# Altium schematic sheet demo_V1 SMALL SIZE.SchDoc: Sinowealth SH32F205 inverter AIR Conditioner
size A2; DocumentNumber: 1; Revision: V2.0; SheetNumber: 1; SheetTotal: 3; DrawnBy: Shawn; PageSetup: Record=PageOptions|CenterHorizontal=True|CenterVertical=True|PrintScale=0.71|XCorrection=1.00|YCorrection=1.00|PrintKind=2|BorderSize=5000000|LeftOffset=0|BottomOffset=0|Orientation=2|PaperLength=1000|PaperWidth=1000|Scale=100|PaperSource=7|PrintQuality=-4|MediaType=1|DitherType=10|PaperKind=A4|PrintScaleMode=1
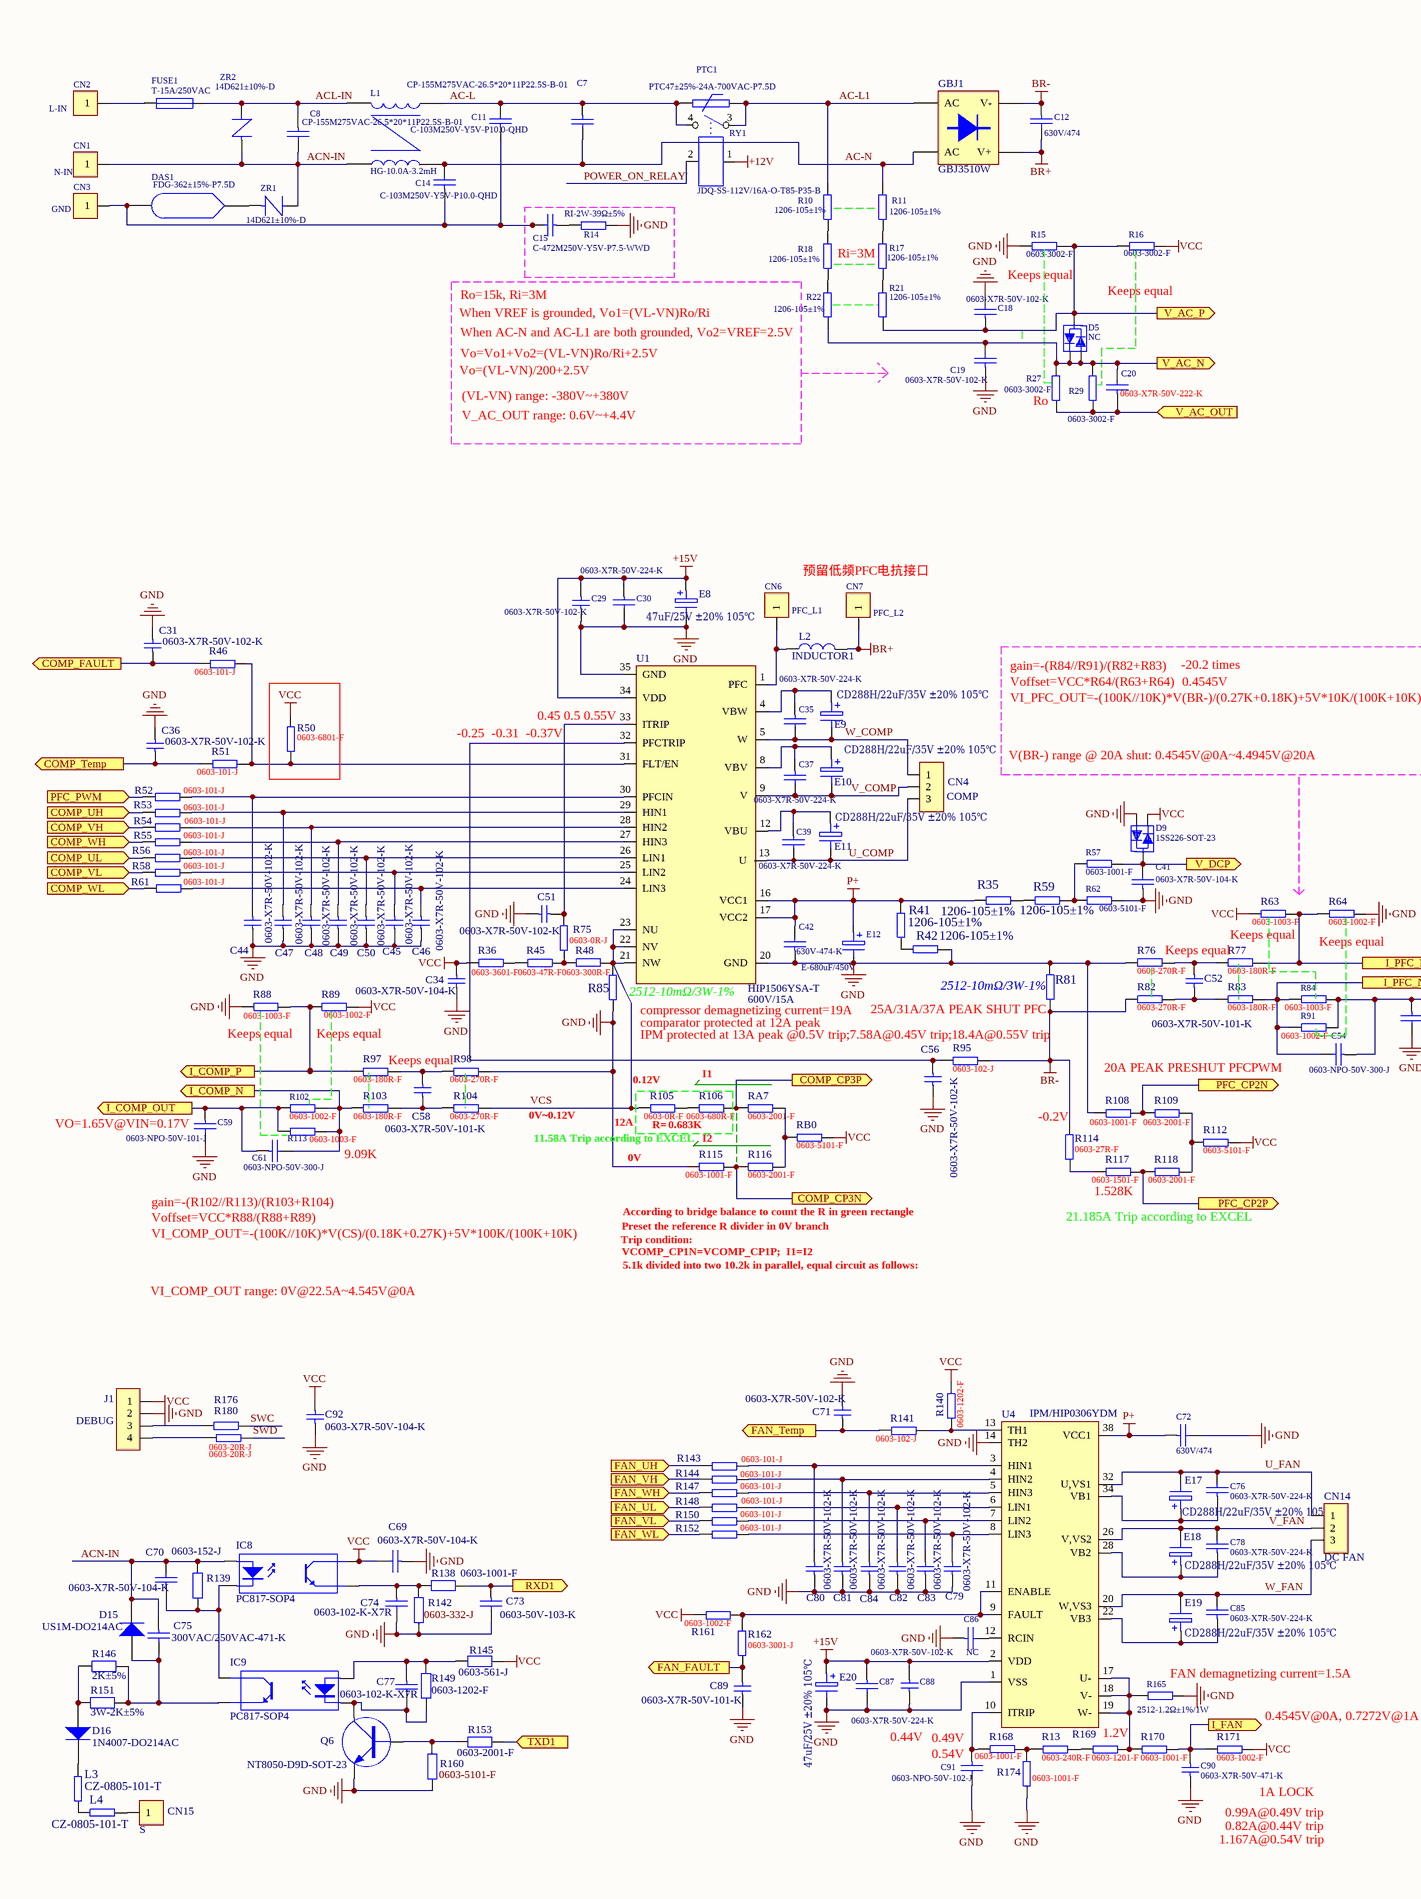
[diagram p0: demo_V1 SMALL SIZE.SchDoc, left]
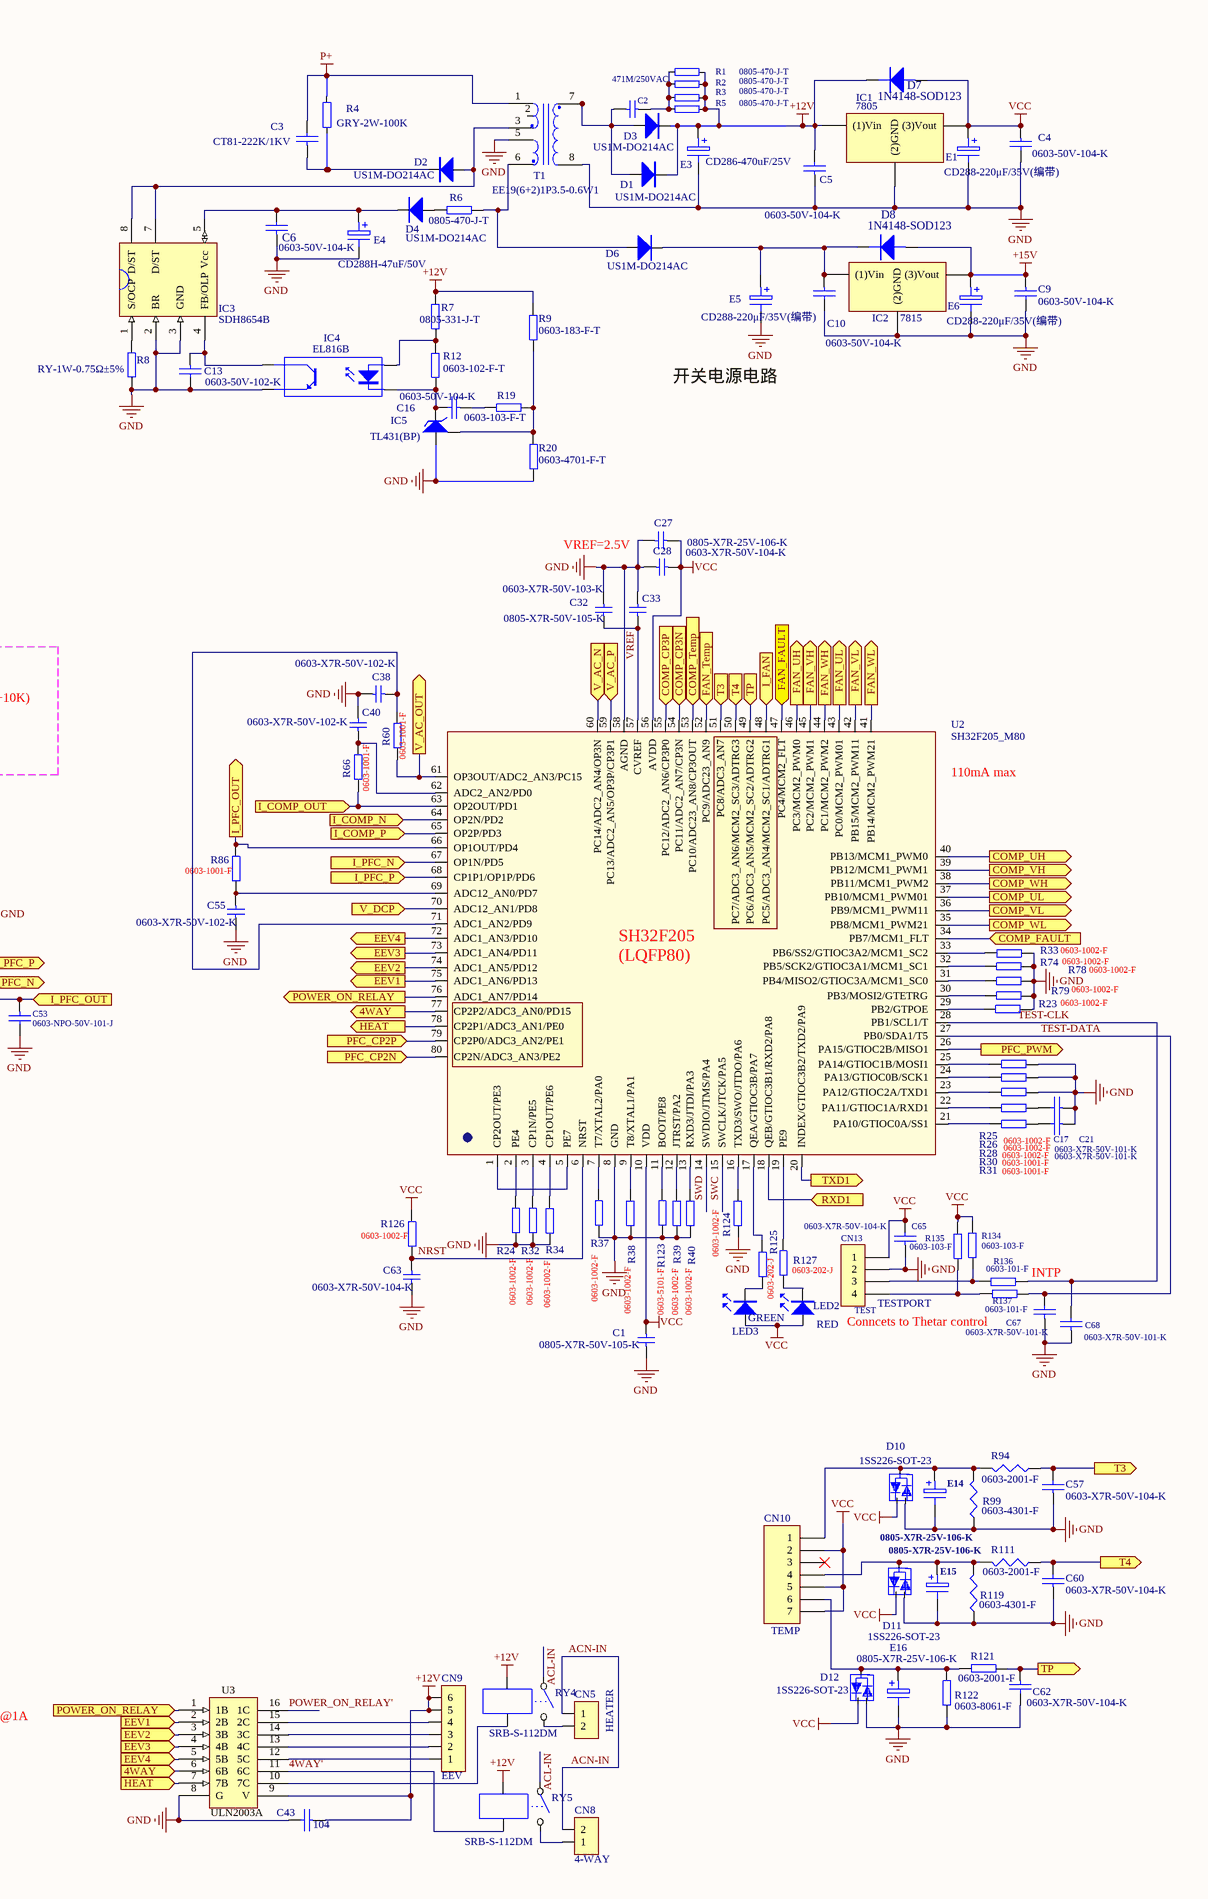
[diagram p1: demo_V1 SMALL SIZE.SchDoc, right]

## Parts
C1  0805-X7R-50V-105-K  [R-SMT-SP-CAP/0805]
C2  471M/250VAC  [S-C/5-AI]
C3  CT81-222K/1KV  [S-C/5-AI]
C4  0603-50V-104-K  [R-SMT-SP-CAP/0603]
C5  0603-50V-104-K  [R-SMT-SP-CAP/0603]
C6  0603-50V-104-K  [R-SMT-SP-CAP/0603]
C7  CP-155M275VAC-26.5*20*11P22.5S-B-01  [S-C/22.5]
C8  CP-155M275VAC-26.5*20*11P22.5S-B-01  [S-C/22.5]
C9  0603-50V-104-K  [R-SMT-SP-CAP/0603]
C10  0603-50V-104-K  [R-SMT-SP-CAP/0603]
C11  C-103M250V-Y5V-P10.0-QHD  [S-C/7.5+10/13X3-AI]
C12  630V/474  [S-C/22.5/25X8.5]
C13  0603-50V-102-K  [R-SMT-SP-CAP/0603]
C14  C-103M250V-Y5V-P10.0-QHD  [S-C/7.5+10/13X3-AI]
C15  C-472M250V-Y5V-P7.5-WWD  [S-C/7.5+10/13X3-AI]
C16  0603-50V-104-K  [R-SMT-SP-CAP/0603]
C17  0603-X7R-50V-101-K  [C/0603-SMT]
C18  0603-X7R-50V-102-K  [R-SMT-SP-CAP/0603]
C19  0603-X7R-50V-102-K  [R-SMT-SP-CAP/0603]
C20  0603-X7R-50V-222-K  [R-SMT-SP-CAP/0603]
C21  0603-X7R-50V-101-K  [C/0603-SMT]
C27  0805-X7R-25V-106-K  [R-SMT-SP-CAP/0805]
C28  0603-X7R-50V-104-K  [R-SMT-SP-CAP/0603]
C29  0603-X7R-50V-102-K  [R-SMT-SP-CAP/0603]
C30  0603-X7R-50V-224-K  [R-SMT-SP-CAP/0603]
C31  0603-X7R-50V-102-K  [R-SMT-SP-CAP/0603]
C32  0805-X7R-50V-105-K  [R-SMT-SP-CAP/0805]
C33  0603-X7R-50V-103-K  [R-SMT-SP-CAP/0603]
C34  0603-X7R-50V-104-K  [R-SMT-SP-CAP/0603]
C35  0603-X7R-50V-224-K  [R-SMT-SP-CAP/0603]
C36  0603-X7R-50V-102-K  [R-SMT-SP-CAP/0603]
C37  0603-X7R-50V-224-K  [R-SMT-SP-CAP/0603]
C38  0603-X7R-50V-102-K  [R-SMT-SP-CAP/0603]
C39  0603-X7R-50V-224-K  [R-SMT-SP-CAP/0603]
C40  0603-X7R-50V-102-K  [R-SMT-SP-CAP/0603]
C41  0603-X7R-50V-104-K  [R-SMT-SP-CAP/0603]
C42  630V-474-K  [C/15/17/8.2]
C43  104  [C/0805]
C44  0603-X7R-50V-102-K  [R-SMT-SP-CAP/0603]
C45  0603-X7R-50V-102-K  [R-SMT-SP-CAP/0603]
C46  0603-X7R-50V-102-K  [R-SMT-SP-CAP/0603]
C47  0603-X7R-50V-102-K  [R-SMT-SP-CAP/0603]
C48  0603-X7R-50V-102-K  [R-SMT-SP-CAP/0603]
C49  0603-X7R-50V-102-K  [R-SMT-SP-CAP/0603]
C50  0603-X7R-50V-102-K  [R-SMT-SP-CAP/0603]
C51  0603-X7R-50V-102-K  [R-SMT-SP-CAP/0603]
C52  0603-X7R-50V-101-K  [R-SMT-SP-CAP/0603]
C53  0603-NPO-50V-101-J  [R-SMT-SP-CAP/0603]
C54  0603-NPO-50V-300-J  [R-SMT-SP-CAP/0603]
C55  0603-X7R-50V-102-K  [R-SMT-SP-CAP/0603]
C56  0603-X7R-50V-102-K  [R-SMT-SP-CAP/0603]
C57  0603-X7R-50V-104-K  [R-SMT-SP-CAP/0603]
C58  0603-X7R-50V-101-K  [R-SMT-SP-CAP/0603]
C59  0603-NPO-50V-101-J  [R-SMT-SP-CAP/0603]
C60  0603-X7R-50V-104-K  [R-SMT-SP-CAP/0603]
C61  0603-NPO-50V-300-J  [R-SMT-SP-CAP/0603]
C62  0603-X7R-50V-104-K  [R-SMT-SP-CAP/0603]
C63  0603-X7R-50V-104-K  [R-SMT-SP-CAP/0603]
C65  0603-X7R-50V-104-K  [C/0603-SMT]
C67  0603-X7R-50V-101-K  [C/0603-SMT]
C68  0603-X7R-50V-101-K  [C/0603-SMT]
C69  0603-X7R-50V-104-K  [R-SMT-SP-CAP/0603]
C70  0603-X7R-50V-104-K  [R-SMT-SP-CAP/0603]
C71  0603-X7R-50V-102-K  [R-SMT-SP-CAP/0603]
C72  630V/474  [C/15/17/8.2]
C73  0603-50V-103-K  [R-SMT-SP-CAP/0603]
C74  0603-102-K-X7R  [R-SMT-SP-CAP/0603]
C75  300VAC/250VAC-471-K  [S-C/7.5]
C76  0603-X7R-50V-224-K  [R-SMT-SP-CAP/0603]
C77  0603-102-K-X7R  [R-SMT-SP-CAP/0603]
C78  0603-X7R-50V-224-K  [R-SMT-SP-CAP/0603]
C79  0603-X7R-50V-102-K  [R-SMT-SP-CAP/0603]
C80  0603-X7R-50V-102-K  [R-SMT-SP-CAP/0603]
C81  0603-X7R-50V-102-K  [R-SMT-SP-CAP/0603]
C82  0603-X7R-50V-102-K  [R-SMT-SP-CAP/0603]
C83  0603-X7R-50V-102-K  [R-SMT-SP-CAP/0603]
C84  0603-X7R-50V-102-K  [R-SMT-SP-CAP/0603]
C85  0603-X7R-50V-224-K  [R-SMT-SP-CAP/0603]
C86  NC  [R-SMT-SP-CAP/0603]
C87  0603-X7R-50V-224-K  [R-SMT-SP-CAP/0603]
C88  0603-X7R-50V-102-K  [R-SMT-SP-CAP/0603]
C89  0603-X7R-50V-101-K  [R-SMT-SP-CAP/0603]
C90  0603-X7R-50V-471-K  [R-SMT-SP-CAP/0603]
C91  0603-NPO-50V-102-J  [R-SMT-SP-CAP/0603]
C92  0603-X7R-50V-104-K  [R-SMT-SP-CAP/0603]
CN1  N-IN  [0-P]
CN2  L-IN  [0-P]
CN3  GND  [S-P/0/2.5/4.5]
CN4  COMP  [R-SC-CN/FD/4/4/20/8.6(VH-5K2,4)]
CN5  HEATER  [S-CN/7.92/2/L]
CN6  PFC_L1  [R-SC-P/TP2.5SING(14AWG)]
CN7  PFC_L2  [R-SC-P/TP2.5SING(14AWG)]
CN8  4-WAY  [S-CN/7.92/2/L]
CN9  EEV  [S-CN/2.54/6/L]
CN10  TEMP  [R-SC-CN/2.5/7/11.5/4.5/JS]
CN13  TEST  [S-CN/2.54/4/L]
CN14  DC FAN  [R-SC-CN/FD/4/4/20/8.6(VH-5K2,4)]
CN15  S  [0-P]
D1  US1M-DO214AC  [D/SUF4007]
D2  US1M-DO214AC  [D/SUF4007]
D3  US1M-DO214AC  [D/SUF4007]
D4  US1M-DO214AC  [D/SUF4007]
D5  NC  [D/TYPE/1SS226-SMT]
D6  US1M-DO214AC  [D/SUF4007]
D7  1N4148-SOD123  [D/SOD123-SMT]
D8  1N4148-SOD123  [D/SOD123-SMT]
D9  1SS226-SOT-23  [D/TYPE/1SS226-SMT]
D10  1SS226-SOT-23  [D/TYPE/1SS226-SMT]
D11  1SS226-SOT-23  [D/TYPE/1SS226-SMT]
D12  1SS226-SOT-23  [D/TYPE/1SS226-SMT]
D15  US1M-DO214AC  [D/DO214AC-SMT]
D16  1N4007-DO214AC  [D/DO214AC-SMT]
DAS1  FDG-362±15%-P7.5D  [S-DSA/7.5/0.9-AI]
E1  CD288-220μF/35V(编带)  [R-SC-CAP-EC/5/8]
E3  CD286-470uF/25V  [E/5/11-AI]
E4  CD288H-47uF/50V  [E/2.54/6.5-AI]
E5  CD288-220μF/35V(编带)  [R-SC-CAP-EC/5/8]
E6  CD288-220μF/35V(编带)  [R-SC-CAP-EC/5/8]
E8  47uF/25V ±20% 105℃  [E/2.5/5/E1@]
E9  CD288H/22uF/35V ±20% 105℃  [E/2.5/5/E1@]
E10  CD288H/22uF/35V ±20% 105℃  [E/2.5/5/E1@]
E11  CD288H/22uF/35V ±20% 105℃  [E/2.5/5/E1@]
E12  E-680uF/450V  [S-E/10/36L-1]
E14  0805-X7R-25V-106-K  [R-SMT-SP-CAP/0805]
E15  0805-X7R-25V-106-K  [R-SMT-SP-CAP/0805]
E16  0805-X7R-25V-106-K  [R-SMT-SP-CAP/0805]
E17  CD288H/22uF/35V ±20% 105℃  [E/2.5/5/E1@]
E18  CD288H/22uF/35V ±20% 105℃  [E/2.5/5/E1@]
E19  CD288H/22uF/35V ±20% 105℃  [E/2.5/5/E1@]
E20  47uF/25V ±20% 105℃  [E/2.5/5/E1@]
FUSE1  T-15A/250VAC  [S-FU/2/32/7]
GBJ1  GBJ3510W  [R-SC-DIO-DB/AC-DC1(WS)]
IC1  7805  [R-SMT-SP-IC/78XX]
IC2  7815  [R-SMT-SP-IC/78XX]
IC3  SDH8654B  [IC/DIP/8]
IC4  EL816B  [IC/DIP/4/1]
IC5  TL431(BP)  [Q/SOT23-SMT-431]
IC8  PC817-SOP4  [R-SMT-SP-IC/SOP/2.54/4]
IC9  PC817-SOP4  [R-SMT-SP-IC/SOP/2.54/4]
J1  DEBUG  [SIP4]
L1  HG-10.0A-3.2mH  [0-S-L/4/50/35/]
L2  INDUCTOR1  [0-L/10A-400uH]
L3  CZ-0805-101-T  [R/0805-SMT]
L4  CZ-0805-101-T  [R/0805-SMT]
LED2  RED  [R-SMT-SP-LED/0603]
LED3  GREEN  [R-SMT-SP-LED/0603]
PTC1  PTC47±25%-24A-700VAC-P7.5D  [S-PTC/03]
Q6  NT8050-D9D-SOT-23  [Q/SOT23-SMT]
R1  0805-470-J-T  [R/0805]
R2  0805-470-J-T  [R/0805]
R3  0805-470-J-T  [R/0805]
R4  GRY-2W-100K  [S-R/5/2W/R1-AI]
R5  0805-470-J-T  [R/0805]
R6  0805-470-J-T  [R/0805]
R7  0805-331-J-T  [R/0805]
R8  RY-1W-0.75Ω±5%  [S-R/5/1W/R1-AI]
R9  0603-183-F-T  [R-SMT-SP-RES/0603]
R10  1206-105±1%  [R/1206]
R11  1206-105±1%  [R/1206]
R12  0603-102-F-T  [R-SMT-SP-RES/0603]
R13  0603-240R-F  [R-SMT-SP-RES/0603]
R14  RI-2W-39Ω±5%  [S-R/5/1W/R1-AI]
R15  0603-3002-F  [R-SMT-SP-RES/0603]
R16  0603-3002-F  [R-SMT-SP-RES/0603]
R17  1206-105±1%  [R/1206]
R18  1206-105±1%  [R/1206]
R19  0603-103-F-T  [R-SMT-SP-RES/0603]
R20  0603-4701-F-T  [R-SMT-SP-RES/0603]
R21  1206-105±1%  [R/1206]
R22  1206-105±1%  [R/1206]
R23  0603-1002-F  [R-SMT-SP-RES/0603]
R24  0603-1002-F  [R-SMT-SP-RES/0603]
R25  0603-1002-F  [R-SMT-SP-RES/0603]
R26  0603-1002-F  [R-SMT-SP-RES/0603]
R27  0603-3002-F  [R-SMT-SP-RES/0603]
R28  0603-1002-F  [R-SMT-SP-RES/0603]
R29  0603-3002-F  [R-SMT-SP-RES/0603]
R30  0603-1001-F  [R-SMT-SP-RES/0603]
R31  0603-1001-F  [R-SMT-SP-RES/0603]
R32  0603-1002-F  [R-SMT-SP-RES/0603]
R33  0603-1002-F  [R-SMT-SP-RES/0603]
R34  0603-1002-F  [R-SMT-SP-RES/0603]
R35  1206-105±1%  [R/1206-SMT]
R36  0603-3601-F  [R-SMT-SP-RES/0603]
R37  0603-1002-F  [R-SMT-SP-RES/0603]
R38  0603-1002-F  [R-SMT-SP-RES/0603]
R39  0603-1002-F  [R-SMT-SP-RES/0603]
R40  0603-1002-F  [R-SMT-SP-RES/0603]
R41  1206-105±1%  [R/1206-SMT]
R42  1206-105±1%  [R/1206-SMT]
R45  0603-47R-F  [R-SMT-SP-RES/0603]
R46  0603-101-J  [R-SMT-SP-RES/0603]
R48  0603-300R-F  [R-SMT-SP-RES/0603]
R50  0603-6801-F  [R-SMT-SP-RES/0603]
R51  0603-101-J  [R-SMT-SP-RES/0603]
R52  0603-101-J  [R-SMT-SP-RES/0603]
R53  0603-101-J  [R-SMT-SP-RES/0603]
R54  0603-101-J  [R-SMT-SP-RES/0603]
R55  0603-101-J  [R-SMT-SP-RES/0603]
R56  0603-101-J  [R-SMT-SP-RES/0603]
R57  0603-1001-F  [R-SMT-SP-RES/0603]
R58  0603-101-J  [R-SMT-SP-RES/0603]
R59  1206-105±1%  [R/1206-SMT]
R60  0603-1001-F  [R-SMT-SP-RES/0603]
R61  0603-101-J  [R-SMT-SP-RES/0603]
R62  0603-5101-F  [R-SMT-SP-RES/0603]
R63  0603-1003-F  [R-SMT-SP-RES/0603]
R64  0603-1002-F  [R-SMT-SP-RES/0603]
R66  0603-1001-F  [R-SMT-SP-RES/0603]
R74  0603-1002-F  [R-SMT-SP-RES/0603]
R75  0603-0R-J  [R-SMT-SP-RES/0603]
R76  0603-270R-F  [R-SMT-SP-RES/0603]
R77  0603-180R-F  [R-SMT-SP-RES/0603]
R78  0603-1002-F  [R-SMT-SP-RES/0603]
R79  0603-1002-F  [R-SMT-SP-RES/0603]
R81  2512-10mΩ/3W-1%  [R/2512-SMT]
R82  0603-270R-F  [R-SMT-SP-RES/0603]
R83  0603-180R-F  [R-SMT-SP-RES/0603]
R84  0603-1003-F  [R-SMT-SP-RES/0603]
R85  2512-10mΩ/3W-1%  [R/2512-SMT]
R86  0603-1001-F  [R-SMT-SP-RES/0603]
R88  0603-1003-F  [R-SMT-SP-RES/0603]
R89  0603-1002-F  [R-SMT-SP-RES/0603]
R91  0603-1002-F  [R-SMT-SP-RES/0603]
R94  0603-2001-F  [R-SMT-SP-RES/0603]
R95  0603-102-J  [R-SMT-SP-RES/0603]
R97  0603-180R-F  [R-SMT-SP-RES/0603]
R98  0603-270R-F  [R-SMT-SP-RES/0603]
R99  0603-4301-F  [R-SMT-SP-RES/0603]
R102  0603-1002-F  [R-SMT-SP-RES/0603]
R103  0603-180R-F  [R-SMT-SP-RES/0603]
R104  0603-270R-F  [R-SMT-SP-RES/0603]
R105  0603-0R-F  [R-SMT-SP-RES/0603]
R106  0603-680R-F  [R-SMT-SP-RES/0603]
R108  0603-1001-F  [R-SMT-SP-RES/0603]
R109  0603-2001-F  [R-SMT-SP-RES/0603]
R111  0603-2001-F  [R-SMT-SP-RES/0603]
R112  0603-5101-F  [R-SMT-SP-RES/0603]
R113  0603-1003-F  [R-SMT-SP-RES/0603]
R114  0603-27R-F  [R-SMT-SP-RES/0603]
R115  0603-1001-F  [R-SMT-SP-RES/0603]
R116  0603-2001-F  [R-SMT-SP-RES/0603]
R117  0603-1501-F  [R-SMT-SP-RES/0603]
R118  0603-2001-F  [R-SMT-SP-RES/0603]
R119  0603-4301-F  [R-SMT-SP-RES/0603]
R121  0603-2001-F  [R-SMT-SP-RES/0603]
R122  0603-8061-F  [R-SMT-SP-RES/0603]
R123  0603-5101-F  [R-SMT-SP-RES/0603]
R124  0603-1002-F  [R-SMT-SP-RES/0603]
R125  0603-202-J  [R-SMT-SP-RES/0603]
R126  0603-1002-F  [R-SMT-SP-RES/0603]
R127  0603-202-J  [R-SMT-SP-RES/0603]
R134  0603-103-F  [R/0603-SMT]
R135  0603-103-F  [R/0603-SMT]
R136  0603-101-F  [R/0603-SMT]
R137  0603-101-F  [R/0603-SMT]
R138  0603-1001-F  [R-SMT-SP-RES/0603]
R139  0603-152-J  [R-SMT-SP-RES/0603]
R140  0603-1202-F  [R-SMT-SP-RES/0603]
R141  0603-102-J  [R-SMT-SP-RES/0603]
R142  0603-332-J  [R-SMT-SP-RES/0603]
R143  0603-101-J  [R-SMT-SP-RES/0603]
R144  0603-101-J  [R-SMT-SP-RES/0603]
R145  0603-561-J  [R-SMT-SP-RES/0603]
R146  2K±5%  [S-R/5/2W/R1-AI]
R147  0603-101-J  [R-SMT-SP-RES/0603]
R148  0603-101-J  [R-SMT-SP-RES/0603]
R149  0603-1202-F  [R-SMT-SP-RES/0603]
R150  0603-101-J  [R-SMT-SP-RES/0603]
R151  3W-2K±5%  [S-R/10/3W-AI]
R152  0603-101-J  [R-SMT-SP-RES/0603]
R153  0603-2001-F  [R-SMT-SP-RES/0603]
R160  0603-5101-F  [R-SMT-SP-RES/0603]
R161  0603-1002-F  [R-SMT-SP-RES/0603]
R162  0603-3001-J  [R-SMT-SP-RES/0603]
R165  2512-1.2Ω±1%/1W  [R/2512-SMT]
R168  0603-1001-F  [R-SMT-SP-RES/0603]
R169  0603-1201-F  [R-SMT-SP-RES/0603]
R170  0603-1001-F  [R-SMT-SP-RES/0603]
R171  0603-1002-F  [R-SMT-SP-RES/0603]
R174  0603-1001-F  [R-SMT-SP-RES/0603]
R176  0603-20R-J  [R-SMT-SP-RES/0603]
R180  0603-20R-J  [R-SMT-SP-RES/0603]
RA7  0603-2001-F  [R-SMT-SP-RES/0603]
RB0  0603-5101-F  [R-SMT-SP-RES/0603]
RY1  JDQ-SS-112V/16A-O-T85-P35-B  [RY/OJE-SS]
RY4  SRB-S-112DM  [RY/G5N-1A]
RY5  SRB-S-112DM  [RY/G5N-1A]
T1  EE19(6+2)1P3.5-0.6W1  [S-TR/EE1905N111]
U1  HIP1506YSA-T  [IPM/HIP1506YSA-T]
U2  SH32F205_M80  [IC/LQFP80L]
U3  ULN2003A  [IC/SOP/1.27/16-SMT]
U4  IPM/HIP0306YDM  [IPM/HIP0306YDM]
ZR1  14D621±10%-D  [S-ZR/7.5/8/15-AI]
ZR2  14D621±10%-D  [S-ZR/7.5/8/15-AI]

## Ports
4WAY (in), 4WAY (out), COMP_CP3N (in), COMP_CP3N (out), COMP_CP3P (in), COMP_CP3P (out), COMP_FAULT (in), COMP_FAULT (out), COMP_Temp (in), COMP_Temp (out), COMP_UH (in), COMP_UH (out), COMP_UL (in), COMP_UL (out), COMP_VH (in), COMP_VH (out), COMP_VL (in), COMP_VL (out), COMP_WH (in), COMP_WH (out), COMP_WL (in), COMP_WL (out), EEV1 (in), EEV1 (out), EEV2 (in), EEV2 (out), EEV3 (in), EEV3 (out), EEV4 (in), EEV4 (out), FAN_FAULT (in), FAN_FAULT (out), FAN_Temp (in), FAN_Temp (out), FAN_UH (in), FAN_UH (out), FAN_UL (in), FAN_UL (out), FAN_VH (in), FAN_VH (out), FAN_VL (in), FAN_VL (out), FAN_WH (in), FAN_WH (out), FAN_WL (in), FAN_WL (out), HEAT (in), HEAT (out), I_COMP_N (in), I_COMP_N (out), I_COMP_OUT (in), I_COMP_OUT (out), I_COMP_P (in), I_COMP_P (out), I_FAN (in), I_FAN (out), I_PFC_N (in), I_PFC_N (out), I_PFC_OUT (in), I_PFC_OUT (out), I_PFC_P (in), I_PFC_P (out), PFC_CP2N (in), PFC_CP2N (out), PFC_CP2P (in), PFC_CP2P (out), PFC_PWM (in), PFC_PWM (out), POWER_ON_RELAY (in), POWER_ON_RELAY (out), RXD1 (in), RXD1 (out), T3 (in), T3 (out), T4 (in), T4 (out), TP (in), TP (out), TXD1 (in), TXD1 (out), V_AC_N (in), V_AC_N (out), V_AC_OUT (in), V_AC_OUT (out), V_AC_P (in), V_AC_P (out), V_DCP (in), V_DCP (out)

## Nets
1: DAS1.1 ZR1.2
2: C11.1 C14.1 C15.2 CN3.1 DAS1.2
+12V: C5.2 C43.1 CN9.5 CN9.6 D1.K D3.K D7.K E3.1 IC1.1((1)Vin) R1.1 R2.1 R3.1 R5.1 R7.2 R9.2 RY1.1 RY4.3 RY5.3 U3.9(V)
+15V: C9.1 C29.1 C30.1 C87.1 C88.1 D8.A E6.1 E8.1 E20.1 IC2.3((3)Vout) U1.34(VDD) U4.2(VDD)
BR+: C12.2 CN7.1 GBJ1.1(V+) L2.2
BR-: C12.1 GBJ1.4(V-) R81.2 R82.2 R95.2 R114.2
GND: C1.1 C4.2 C5.1 C6.1 C9.2 C10.2 C13.2 C17.1 C18.2 C19.1 C21.1 C27.1 C28.1 C29.2 C30.2 C31.1 C32.2 C33.2 C34.2 C36.1 C38.1 C40.1 C41.1 C42.1 C43.2 C44.2 C45.2 C46.2 C47.2 C48.2 C49.2 C50.2 C51.2 C53.2 C55.2 C56.1 C57.1 C59.2 C60.1 C62.2 C63.2 C65.1 C67.1 C68.1 C69.1 C71.1 C72.2 C73.2 C74.2 C79.2 C80.2 C81.2 C82.2 C83.2 C84.2 C86.1 C87.2 C88.2 C89.2 C90.2 C91.2 C92.1 CN13.2 D9.A D10.A D11.A D12.A E1.2 E3.2 E4.2 E5.2 E6.2 E8.2 E12.2 E14.2 E15.2 E16.2 E20.2 IC1.2((2)GND) IC2.2((2)GND) IC3.2(BR) IC3.3(GND) IC4.E IC5.2 J1.2 Q6.E R8.2 R14.2 R15.1 R20.2 R23.1 R24.2 R25.1 R26.1 R28.1 R32.2 R33.2 R34.1 R37.2 R38.1 R39.1 R40.1 R42.1 R62.1 R64.1 R74.1 R76.2 R78.1 R79.1 R81.1 R85.1 R88.1 R98.2 R99.2 R108.1 R115.1 R119.2 R122.1 R123.2 R124.1 R142.2 R160.2 R165.2 R174.1 T1.5 T1.8 U1.20(GND) U1.35(GND) U2.8(GND) U2.58(AGND) U3.8(G) U4.1(VSS) U4.14(TH2)
P+: C3.2 C42.2 C72.1 E12.1 R4.1 R35.2 R41.2 T1.1 U1.16(VCC1) U1.17(VCC2) U4.38(VCC1)
VCC: C1.2 C4.1 C27.2 C28.2 C34.1 C65.2 C69.2 C92.2 CN10.2 CN10.5 CN10.7 CN13.1 D7.A D9.K D10.K D11.K D12.K E1.1 IC1.3((3)Vout) IC8.C J1.1 LED2.A LED3.A R16.2 R36.1 R50.1 R63.2 R89.2 R112.2 R126.1 R134.2 R135.2 R140.1 R145.1 R161.1 R171.2 RB0.2 U2.10(VDD) U2.56(AVDD)
4WAY: U2.77(CP2P2/ADC3_AN0/PD15) U3.6(6B) ; port 4WAY
4WAY': RY5.4 U3.11(6C)
AC-L: C7.1 C11.2 L1.4 PTC1.1 RY1.4
AC-L1: GBJ1.3(AC) PTC1.2 R10.1 RY1.3
AC-N: C7.2 C14.2 GBJ1.2(AC) L1.3 R11.1
ACL-IN: C8.1 FUSE1.2 L1.2 RY4.1 RY5.1 ZR2.1
ACN-IN: C8.2 C70.2 C75.1 CN1.1 CN5.1 CN8.2 D15.K IC8.A L1.1 R139.1 ZR1.1 ZR2.2
COMP_CP3N: R115.2 R116.1 U2.54(PC11/ADC2_AN7/CP3N) ; port COMP_CP3N
COMP_CP3P: R106.2 RA7.1 U2.55(PC12/ADC2_AN6/CP3P0) ; port COMP_CP3P
COMP_FAULT: C31.2 R46.1 U2.34(PB7/MCM1_FLT) ; port COMP_FAULT
COMP_Temp: C36.2 R51.1 U2.53(PC10/ADC23_AN8/CP3OUT) ; port COMP_Temp
COMP_UH: R53.1 U2.40(PB13/MCM1_PWM0) ; port COMP_UH
COMP_UL: R56.1 U2.37(PB10/MCM1_PWM01) ; port COMP_UL
COMP_VH: R54.1 U2.39(PB12/MCM1_PWM1) ; port COMP_VH
COMP_VL: R58.1 U2.36(PB9/MCM1_PWM11) ; port COMP_VL
COMP_WH: R55.1 U2.38(PB11/MCM1_PWM2) ; port COMP_WH
COMP_WL: R61.1 U2.35(PB8/MCM1_PWM21) ; port COMP_WL
EEV1: U2.75(ADC1_AN6/PD13) U3.2(2B) ; port EEV1
EEV2: U2.74(ADC1_AN5/PD12) U3.3(3B) ; port EEV2
EEV3: U2.73(ADC1_AN4/PD11) U3.4(4B) ; port EEV3
EEV4: U2.72(ADC1_AN3/PD10) U3.5(5B) ; port EEV4
FAN_FAULT: C89.1 R162.1 U2.47(PC4/MCM2_FLT) ; port FAN_FAULT
FAN_Temp: C71.2 R141.1 U2.52(PC9/ADC23_AN9) ; port FAN_Temp
FAN_UH: R143.1 U2.46(PC3/MCM2_PWM0) ; port FAN_UH
FAN_UL: R148.1 U2.43(PC0/MCM2_PWM01) ; port FAN_UL
FAN_VH: R144.1 U2.45(PC2/MCM2_PWM1) ; port FAN_VH
FAN_VL: R150.1 U2.42(PB15/MCM2_PWM11) ; port FAN_VL
FAN_WH: R147.1 U2.44(PC1/MCM2_PWM2) ; port FAN_WH
FAN_WL: R152.1 U2.41(PB14/MCM2_PWM21) ; port FAN_WL
HEAT: U2.78(CP2P1/ADC3_AN1/PE0) U3.7(7B) ; port HEAT
I_COMP_N: U2.64(OP2N/PD2) ; port I_COMP_N
I_COMP_OUT: C59.1 C61.1 R66.2 R102.1 R113.1 U2.63(OP2OUT/PD1) ; port I_COMP_OUT
I_COMP_P: R88.2 R89.1 R97.1 U2.65(OP2P/PD3) ; port I_COMP_P
I_FAN: C90.1 R170.2 R171.1 U2.48(PC5/ADC3_AN4/MCM2_SC1/ADTRG1) ; port I_FAN
I_PFC_N: C54.2 R83.1 R84.2 R91.2 U2.67(OP1N/PD5) ; port I_PFC_N
I_PFC_OUT: C53.1 C54.1 R84.1 R86.1 R91.1 U2.66(OP1OUT/PD4) ; port I_PFC_OUT
I_PFC_P: R63.1 R64.2 R77.1 U2.68(CP1P1/OP1P/PD6) ; port I_PFC_P
NRST: C63.1 R126.2 U2.6(NRST)
PFC_CP2N: R108.2 R109.1 U2.80(CP2N/ADC3_AN3/PE2) ; port PFC_CP2N
PFC_CP2P: R117.2 R118.1 U2.79(CP2P0/ADC3_AN2/PE1) ; port PFC_CP2P
PFC_PWM: R52.1 U2.26(PA15/GTIOC2B/MISO1) ; port PFC_PWM
POWER_ON_RELAY: U2.76(ADC1_AN7/PD14) U3.1(1B) ; port POWER_ON_RELAY
POWER_ON_RELAY': RY1.2 U3.16(1C)
RXD1: C73.1 R138.2 U2.18(QEB/GTIOC3B1/RXD2/PA8) ; port RXD1
SWC: R176.2 U2.15(SWCLK/JTCK/PA5)
SWD: R180.2 U2.14(SWDIO/JTMS/PA4)
T3: C57.2 R94.2 U2.51(PC8/ADC3_AN7) ; port T3
T4: C60.2 R111.2 U2.50(PC7/ADC3_AN6/MCM2_SC3/ADTRG3) ; port T4
TEST-CLK: C68.2 R136.2 U2.28(PB1/SCL1/T)
TEST-DATA: C67.2 R137.2 U2.27(PB0/SDA1/T5)
TP: C62.1 R121.1 U2.49(PC6/ADC3_AN5/MCM2_SC2/ADTRG2) ; port TP
TXD1: R153.1 U2.20(INDEX/GTIOC3B2/TXD2/PA9) ; port TXD1
U_COMP: C39.2 CN4.3 E11.2 U1.13(U)
U_FAN: C76.2 CN14.1 E17.2 U4.32(U,VS1)
V_AC_N: C19.2 C20.2 D5.A D5.K R22.2 R27.2 R29.2 U2.60(PC14/ADC2_AN4/OP3N) ; port V_AC_N
V_AC_OUT: C20.1 R27.1 R29.1 R60.2 U2.61(OP3OUT/ADC2_AN3/PC15) ; port V_AC_OUT
V_AC_P: C18.1 D5.KA R15.2 R16.1 R21.2 U2.59(PC13/ADC2_AN5/OP3P/CP3P1) ; port V_AC_P
V_COMP: C37.2 CN4.2 E10.2 U1.9(V)
V_DCP: C41.2 D9.KA R57.1 U2.70(ADC12_AN1/PD8) ; port V_DCP
V_FAN: C78.2 CN14.2 E18.2 U4.26(V,VS2)
VCS: R48.1 R85.2 R104.2 R105.1 U1.21(NW) U1.22(NV) U1.23(NU)
VREF: C32.1 C33.1 U2.57(CVREF)
W_COMP: C35.2 CN4.1 E9.2 U1.5(W)
W_FAN: C85.2 CN14.3 E19.2 U4.20(W,VS3)
NetC2_1: C2.1 R1.2 R2.2 R3.2 R5.2
NetC2_2: C2.2 D1.A D3.A T1.7
NetC3_1: C3.1 D2.K R4.2
NetC6_2: C6.2 D4.K E4.1 IC3.5(Vcc)
NetC10_1: C10.1 D6.K D8.K E5.1 IC2.1((1)Vin)
NetC13_1: C13.1 IC3.4(FB/OLP) IC4.C
NetC15_1: C15.1 R14.1
NetC16_1: C16.1 R19.2
NetC16_2: C16.2 IC4.K IC5.3 R12.1
NetC17_2: C17.2 R31.1
NetC21_2: C21.2 R30.1
NetC35_1: C35.1 E9.1 U1.4(VBW)
NetC37_1: C37.1 E10.1 U1.8(VBV)
NetC38_2: C38.2 R60.1 U2.71(ADC1_AN2/PD9)
NetC39_1: C39.1 E11.1 U1.12(VBU)
NetC40_2: C40.2 R66.1 U2.62(ADC2_AN2/PD0)
NetC44_1: C44.1 R52.2 U1.30(PFCIN)
NetC45_1: C45.1 R58.2 U1.25(LIN2)
NetC46_1: C46.1 R61.2 U1.24(LIN3)
NetC47_1: C47.1 R53.2 U1.29(HIN1)
NetC48_1: C48.1 R54.2 U1.28(HIN2)
NetC49_1: C49.1 R55.2 U1.27(HIN3)
NetC50_1: C50.1 R56.2 U1.26(LIN1)
NetC51_1: C51.1 R75.2 U1.33(ITRIP)
NetC52_1: C52.1 R76.1 R77.2
NetC52_2: C52.2 R82.1 R83.2
NetC55_1: C55.1 R86.2 U2.69(ADC12_AN0/PD7)
NetC56_2: C56.2 R95.1 U1.32(PFCTRIP)
NetC58_1: C58.1 R97.2 R98.1
NetC58_2: C58.2 R103.2 R104.1
NetC61_2: C61.2 R102.2 R103.1 R113.2
NetC70_1: C70.1 IC8.K IC9.C R139.2
NetC74_1: C74.1 IC8.E R138.1 R142.1
NetC75_2: C75.2 D15.A IC9.E R146.1 R151.1
NetC76_1: C76.1 E17.1 U4.34(VB1)
NetC77_1: C77.1 IC9.A R145.2 R149.1
NetC77_2: C77.2 IC9.K Q6.C R149.2
NetC78_1: C78.1 E18.1 U4.28(VB2)
NetC79_1: C79.1 R152.2 U4.8(LIN3)
NetC80_1: C80.1 R143.2 U4.3(HIN1)
NetC81_1: C81.1 R144.2 U4.4(HIN2)
NetC82_1: C82.1 R148.2 U4.6(LIN1)
NetC83_1: C83.1 R150.2 U4.7(LIN2)
NetC84_1: C84.1 R147.2 U4.5(HIN3)
NetC85_1: C85.1 E19.1 U4.22(VB3)
NetC86_2: C86.2 U4.12(RCIN)
NetC91_1: C91.1 R168.2 U4.10(ITRIP)
NetCN2_1: CN2.1 FUSE1.1
NetCN5_2: CN5.2 RY4.2
NetCN6_1: CN6.1 L2.1 U1.1(PFC)
NetCN8_1: CN8.1 RY5.2
NetCN9_1: CN9.1 U3.12(5C)
NetCN9_2: CN9.2 U3.13(4C)
NetCN9_3: CN9.3 U3.14(3C)
NetCN9_4: CN9.4 U3.15(2C)
NetCN10_1: CN10.1 D10.KA E14.1 R94.1 R99.1
NetCN10_4: CN10.4 D11.KA E15.1 R111.1 R119.1
NetCN10_6: CN10.6 D12.KA E16.1 R121.2 R122.2
NetCN13_3: CN13.3 R134.1 R136.1
NetCN13_4: CN13.4 R135.1 R137.1
NetCN15_1: CN15.1 L4.1
NetD2_A: D2.A IC3.7(D/ST) IC3.8(D/ST) T1.3
NetD4_A: D4.A R6.1
NetD6_A: D6.A R6.2 T1.6
NetD16_A: D16.A R146.2 R151.2
NetD16_K: D16.K L3.2
NetIC3_1: IC3.1(S/OCP) R8.1
NetIC4_A: IC4.A R7.1 R12.2
NetIC5_1: IC5.1 R9.1 R19.1 R20.1
NetJ1_3: J1.3 R176.1
NetJ1_4: J1.4 R180.1
NetL3_1: L3.1 L4.2
NetLED2_K: LED2.K R127.2
NetLED3_K: LED3.K R125.2
NetQ6_B: Q6.B R153.2 R160.1
NetR10_2: R10.2 R18.1
NetR11_2: R11.2 R17.1
NetR13_1: R13.1 R168.1 R174.2
NetR13_2: R13.2 R169.1
NetR17_2: R17.2 R21.1
NetR18_2: R18.2 R22.1
NetR23_2: R23.2 U2.29(PB2/GTPOE)
NetR24_1: R24.1 U2.2(PE4)
NetR25_2: R25.2 U2.25(PA14/GTIOC1B/MOSI1)
NetR26_2: R26.2 U2.24(PA13/GTIOC0B/SCK1)
NetR28_2: R28.2 U2.23(PA12/GTIOC2A/TXD1)
NetR30_2: R30.2 U2.22(PA11/GTIOC1A/RXD1)
NetR31_2: R31.2 U2.21(PA10/GTIOC0A/SS1)
NetR32_1: R32.1 U2.3(CP1N/PE5)
NetR33_1: R33.1 U2.33(PB6/SS2/GTIOC3A2/MCM1_SC2)
NetR34_2: R34.2 U2.4(CP1OUT/PE6)
NetR35_1: R35.1 R59.2
NetR36_2: R36.2 R45.1
NetR37_1: R37.1 U2.7(T7/XTAL2/PA0)
NetR38_2: R38.2 U2.9(T8/XTAL1/PA1)
NetR39_2: R39.2 U2.12(JTRST/PA2)
NetR40_2: R40.2 U2.13(RXD3/JTDI/PA3)
NetR41_1: R41.1 R42.2
NetR45_2: R45.2 R48.2 R75.1
NetR46_2: R46.2 R50.2 R51.2 U1.31(FLT/EN)
NetR57_2: R57.2 R59.1 R62.2
NetR74_2: R74.2 U2.32(PB5/SCK2/GTIOC3A1/MCM1_SC1)
NetR78_2: R78.2 U2.31(PB4/MISO2/GTIOC3A/MCM1_SC0)
NetR79_2: R79.2 U2.30(PB3/MOSI2/GTETRG)
NetR105_2: R105.2 R106.1
NetR109_2: R109.2 R112.1 R118.2
NetR114_1: R114.1 R117.1
NetR116_2: R116.2 RA7.2 RB0.1
NetR123_1: R123.1 U2.11(BOOT/PE8)
NetR124_2: R124.2 U2.16(TXD3/SWO/JTDO/PA6)
NetR125_1: R125.1 U2.17(QEA/GTIOC3B/PA7)
NetR127_1: R127.1 U2.19(PE9)
NetR140_2: R140.2 R141.2 U4.13(TH1)
NetR161_2: R161.2 R162.2 U4.9(FAULT) U4.11(ENABLE)
NetR165_1: R165.1 R169.2 R170.1 U4.17(U-) U4.18(V-) U4.19(W-)
NetRY4_4: RY4.4 U3.10(7C)
NetU2_1: U2.1(CP2OUT/PE3) U2.5(PE7)

Not connected (* = marked no-connect by the designer): CN10 3*; T1 2

## Notes on the sheet
- Ri=3M
- Keeps equal
- When VREF is grounded, Vo1=(VL-VN)Ro/Ri
- (near R22) When AC-N and AC-L1 are both grounded, Vo2=VREF=2.5V
- Ro=15k, Ri=3M
- Vo=(VL-VN)/200+2.5V
- Vo=Vo1+Vo2=(VL-VN)Ro/Ri+2.5V
- (VL-VN) range: -380V~+380V
- (near R27) Ro
- 开关电源电路
- V_AC_OUT range: 0.6V~+4.4V
- 预留低频PFC电抗接口
- VREF=2.5V
- VI_PFC_OUT=-(100K//10K)*V(BR-)/(0.27K+0.18K)+5V*10K/(100K+10K)
- gain=-(R84//R91)/(R82+R83)
- Voffset=VCC*R64/(R63+R64)
- -20.2 times
- 0.4545V
- (near U1) -0.25  -0.31  -0.37V
- (near U1) 0.45 0.5 0.55V
- V(BR-) range @ 20A shut: 0.4545V@0A~4.4945V@20A
- (near U2) 110mA max
- (near R64) Keeps equal
- compressor demagnetizing current=19A
- (near R81) 25A/31A/37A PEAK SHUT PFC
- (near R85) comparator protected at 12A peak
- IPM protected at 13A peak @0.5V trip;7.58A@0.45V trip;18.4A@0.55V trip
- I1
- 20A PEAK PRESHUT PFCPWM
- (near C59) VO=1.65V@VIN=0.17V
- 0V~0.12V
- (near R105) 12A
- (near R105) 0.12V
- (near R105) R=
- 0.683K
- (near R114) -0.2V
- 9.09K
- 11.58A Trip according to EXCEL
- 0V
- I2
- (near R117) 1.528K
- VI_COMP_OUT=-(100K//10K)*V(CS)/(0.18K+0.27K)+5V*100K/(100K+10K)
- gain=-(R102//R113)/(R103+R104)
- Voffset=VCC*R88/(R88+R89)
- Trip condition:
- VCOMP_CP1N=VCOMP_CP1P;  I1=I2
- Preset the reference R divider in 0V branch
- According to bridge balance to count the R in green rectangle
- 21.185A Trip according to EXCEL
- VI_COMP_OUT range: 0V@22.5A~4.545V@0A
- 5.1k divided into two 10.2k in parallel, equal circuit as follows:
- (near CN13) TESTPORT
- INTP
- Conncets to Thetar control
- (near R165) FAN demagnetizing current=1.5A
- 0.44V
- 0.49V
- (near R169) 1.2V
- (near R171) 0.4545V@0A, 0.7272V@1A
- (near C91) 0.54V
- (near R171) 1A LOCK
- 1.167A@0.54V trip
- 0.99A@0.49V trip
- 0.82A@0.44V trip
- (in symbol IC/SH32F205/PIN80) SH32F205; (LQFP80)
- (in symbol IPM/HIP0306YDM) 600V/3A
- (in symbol IPM/HIP1506YSA-T) 600V/15A

## Library data of the parts
C1 C27 C28 C31-C34 C36 C38 C40 C44-C52 C55 C56 C58 C63 C71 C79-C84 C89 C92 = C: 贴片电容; coding: 202300400053; name: 贴片电容(RoHS); layer: 贴片
C2 = C: Capacitor
C3-C5 C9 C10 C13 C16 C43 = CAP: Capacitor
C6 = CAP_V: Capacitor
C7 = CAP: Capacitor; coding: 11201202000007; name: 薄膜电容(RoHS); layer: 手插
C8 = CAP: Capacitor; coding: 11201202000007; name: 薄膜电容; layer: 手插
C11 C14 = CAP: Capacitor; coding: 11201203000024; name: 瓷片电容(RoHS)(前后打翘,短脚3.8mm,跨距10mm); layer: 机插
C12 = CAP: Capacitor; coding: 11201202000170; name: 薄膜电容(RoHS); layer: 手插
C15 = CAP: Capacitor; coding: 11201203000119; name: 瓷片电容(RoHS)(前后打翘,短脚3.8mm,跨距10mm); layer: 机插
C17 C21 C67 C68 = CAP: Capacitor; coding: 11201209000081; name: 贴片电容(RoHS); layer: 贴片
C18-C20 C30 C35 C37 C39 C41 C53 C54 C57 C59-C62 C69 C70 C73 C74 C76-C78 C85-C87 C91 = CAP: 贴片电容
C29 C88 C90 = C: 贴片电容
C42 C72 = CAP: MKP62电容-X2R-275VAC-474-K 17.5*18.5*7.5mm P=15mm CQC\UL\VDE认证 法拉
C65 = CAP: Capacitor; coding: 11201209000109; name: 贴片电容(RoHS); layer: 贴片
C75 = CAP: Y2电容R-300VAC/250VAC-471-K P=7.5mm 编带 TDK/村田
CN1-CN3 CN6 CN7 = CON1: Connector; coding: 202437300202; name: PFC连接线组; layer: 手插
CN4 CN14 = CON3: Connector
CN5 CN8 = CON2: 插座
CN9 = CON6: Connector
CN10 = He: 温度传感器线组; LatestRevisionDate: 17-Jul-2002; LatestRevisionNote: Re-released for DXP Platform.; Publisher: Altium Limited
CN13 = CON4: Connector; coding: 11201704000632; name: HT202301410031插座(红,RoHS防呆); layer: 手插
CN15 = CON1: Connector
D1-D4 D6 = DIODE
D5 D9 = 0-D/1SS226
D7 D8 = D-HER107: Diode; 代号: DN-L1N4148-SOD123; 编码: 11201504000071; 名称: 常规二极管
D10-D12 = 1SS226: 双向二极管
D15 D16 = Diode: Default Diode; Published: 8-Jun-2000; LatestRevisionDate: 17-Jul-2002; LatestRevisionNote: Re-released for DXP Platform.; Publisher: Altium Limited; Code_JEDEC: DO-214-AB
DAS1 = ASS: coding: 11203002000004; name: 放电管; layer: 机插
E1 E3-E6 = ELECTRO1: Electrolytic Capacitor
E8-E11 E17-E20 = ELECTRO1: 贴片电解电容R-47uF/35V ±20% 105℃ 6.3*5.4mm 利明
E12 = ELECTRO1: Electrolytic Capacitor; coding: 11201205000081; name: 电解电容(RoHS); layer: 手插
E14 E15 = KFR70B.S0: 电解电容R-GR 47μF/25V ±20% 105℃ 5*11mm P=2.5mm
E16 = ELECTRO1: 电解电容R-GR 47μF/25V ±20% 105℃ 5*11mm P=2.5mm
FUSE1 = FUSE: coding: 11203001000133; name: 保险管(带引线,RoHS); layer: 手插
GBJ1 = BRIDGE1: 整流桥堆
IC1 IC2 = VOLTREG
IC3 = IC/STR-A6069H
IC4 IC8 IC9 = OPTOISO1: Optoisolator
IC5 = IC/TL431: coding: 202300700110; name: 集成电路(编带12.7)(RoHS); layer: 机插
J1 = CON4
L1 = PLT1: coding: 11201106000115; name: 共模电感(RoHS); layer: 手插
L2 = INDUCTOR1: INDUCTOR
L3 L4 = RES: 贴片磁珠; 代号: 0805-103-F-1/8W-T; 编码: 11201312000151; 名称: 贴片电阻
LED2 LED3 = LED
PTC1 = THERMAL RESISTOR: coding: 11201307000031; name: 热敏电阻PTC(RoHS); layer: 机插
Q6 = NPN: 贴片三极管
R1-R3 R5 = R: Resistance
R4 = R: Resistance; coding: 202300101012; name: 金属氧化膜电阻(RoHS)  GRY-2W-100KΩ±5%; layer: 手插
R6-R9 R12 R19 R20 R81 R85 = RES
R10 R11 R17 R18 R21 R22 R35 R41 R42 R46 R51-R59 R61-R64 R75-R77 R82-R84 R88 R89 R91 R95 R97 R98 R102-R106 R108 R109 R112-R118 R123 R125 R127 R141 R143 R144 R147 R148 R150 R152 R162 R165 RA7 RB0 = RES: 贴片电阻
R13 R15 R16 R23-R34 R36-R40 R45 R48 R50 R60 R66 R74 R78 R79 R86 R121 R122 R124 R126 R140 R161 R168-R171 R174 R176 R180 = RES5: 贴片电阻
R14 = RES: coding: 11201301000016; name: 玻璃釉电阻; layer: 机插
R94 R99 R111 R119 = RES1: 贴片电阻
R134 R135 = RES5: coding: 11201312000289; name: 贴片电阻(RoHS)(东芝); layer: 贴片
R136 = RES5: coding: 11201312000168; name: 贴片电阻(RoHS); layer: 贴片
R137 = RES5: coding: 11201312000168; name: 贴片电阻(RoHS); coding: 202300200248; layer: 贴片
R138 R139 R142 R145 R149 R153 R160 = Res2: 贴片电阻; Published: 8-Jun-2000; LatestRevisionDate: 17-Jul-2002; LatestRevisionNote: Re-released for DXP Platform.; Publisher: Altium Limited; PackageReference: AXIAL-0.4
R146 R151 = Res2: 松下氧化膜电阻; Published: 8-Jun-2000; LatestRevisionDate: 17-Jul-2002; LatestRevisionNote: Re-released for DXP Platform.; Publisher: Altium Limited; PackageReference: AXIAL-0.4
RY1 = RY-继电器: coding: 11203401000025; name: 继电器(RoHS)(三友/旺荣/欧姆龙/美硕/中汇瑞德); layer: 手插
RY4 RY5 = RELAY-SPST: RELAY
T1 = TRANS9: TRANSFORM; name: 开关变压器; coding: 11203102001031
U1 = IPM/HIP1506YSA-T
U2 = IC/SH32F205/PIN80
U3 = 62003: Driver
ZR1 ZR2 = ZR(DNR): ZR; coding: 11201315000017; name: 封装式压敏电阻(RoHS); layer: 机插